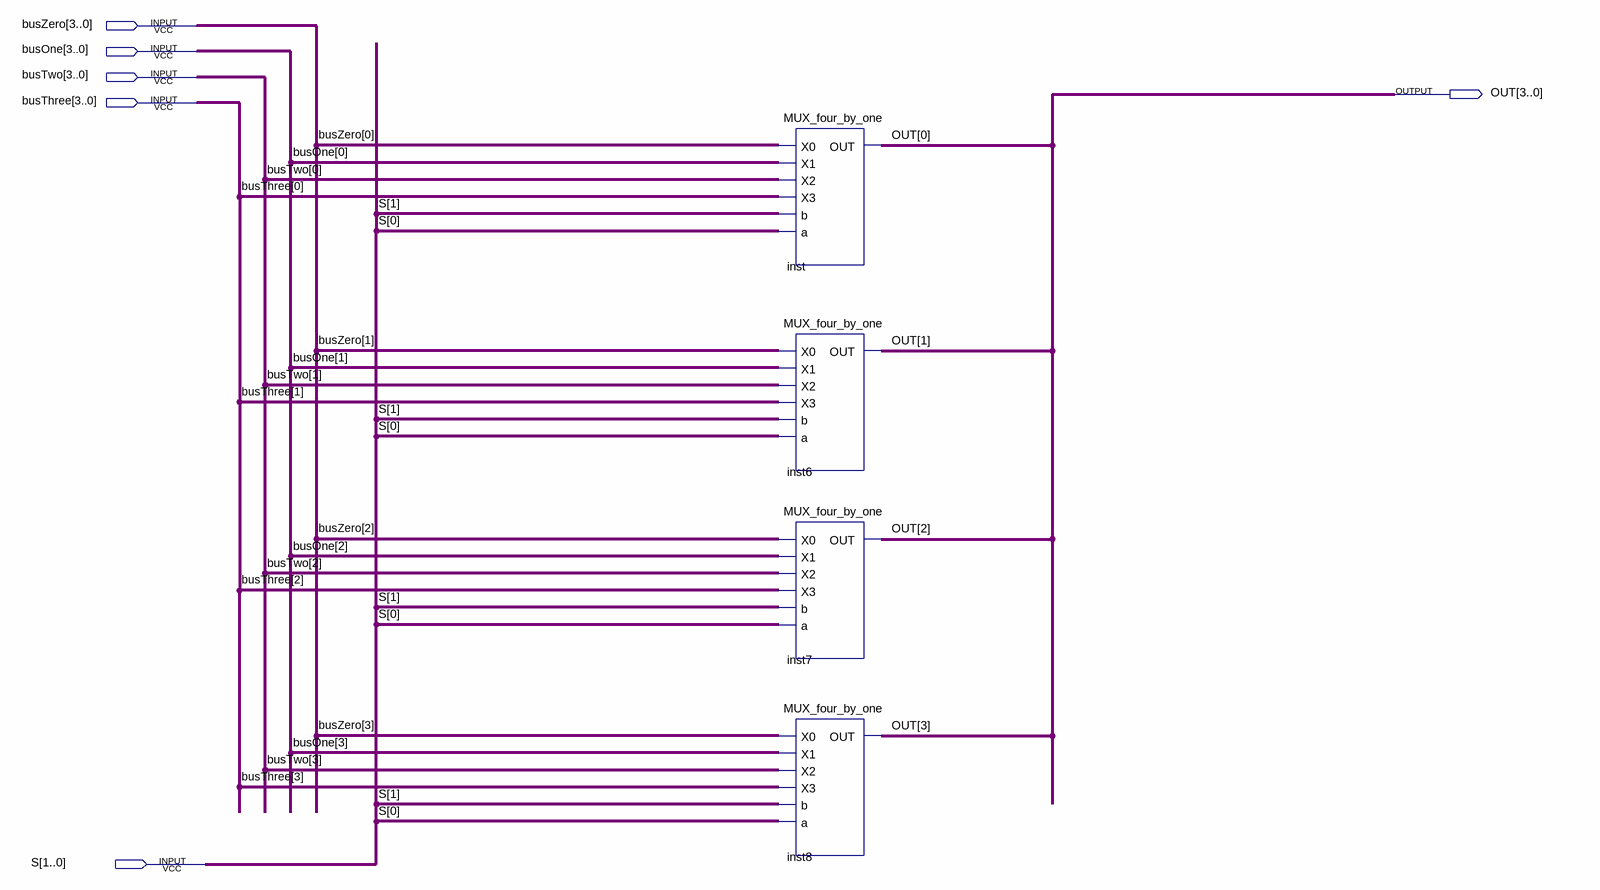
[diagram p0: schematic sheet]
// Quartus schematic fourRegMUX.bdf as structural Verilog: 4 symbols, 6 pins
module fourRegMUX (
  input  [3:0] busZero,
  input  [3:0] busOne,
  input  [3:0] busTwo,
  input  [3:0] busThree,
  input  [1:0] S,
  output [3:0] OUT
);

  MUX_four_by_one inst (
    .X0(busZero[0]), .X1(busOne[0]), .X2(busTwo[0]), .X3(busThree[0]), .b(S[1]), .a(S[0]), .OUT(OUT[0]));
  MUX_four_by_one inst6 (
    .X0(busZero[1]), .X1(busOne[1]), .X2(busTwo[1]), .X3(busThree[1]), .b(S[1]), .a(S[0]), .OUT(OUT[1]));
  MUX_four_by_one inst7 (
    .X0(busZero[2]), .X1(busOne[2]), .X2(busTwo[2]), .X3(busThree[2]), .b(S[1]), .a(S[0]), .OUT(OUT[2]));
  MUX_four_by_one inst8 (
    .X0(busZero[3]), .X1(busOne[3]), .X2(busTwo[3]), .X3(busThree[3]), .b(S[1]), .a(S[0]), .OUT(OUT[3]));
endmodule
